# Altium project CANDAQ.PrjPCB
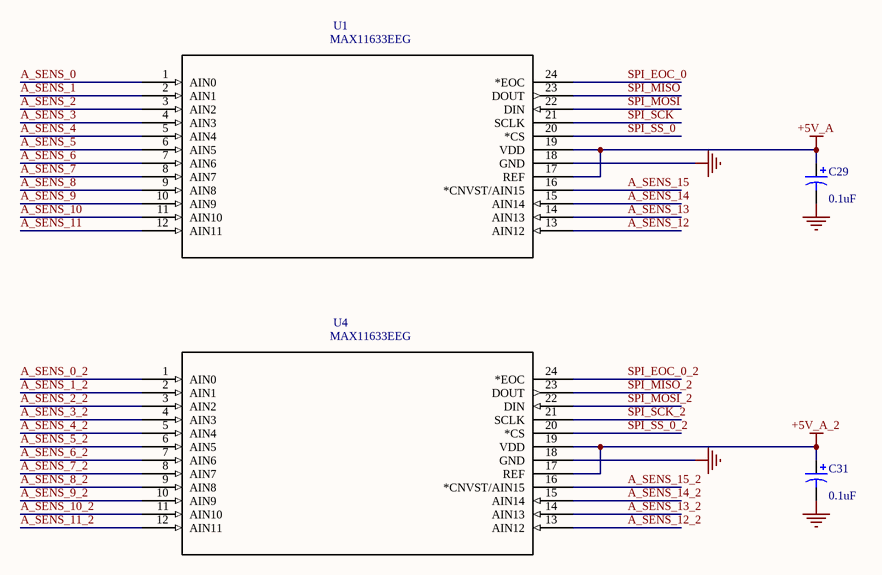
[diagram p0: ADC.SchDoc]
ProjectTitle: CANDAQ
9 sheets, 106 parts. Net scope: global (net labels, ports and power ports of the same name join across sheets).
Board file: CANDAQ.PcbDoc
Sheets:
  ADC.SchDoc
  Connectors.SchDoc
  Peripherials.SchDoc
  Microcontroller.SchDoc
  Strain Gauge Amplifiers.SchDoc
  Power.SchDoc
  Strain Gauge ADC.SchDoc
  bREAKOUT.SchDoc
  MicrocontrollerTwo.SchDoc

## Sheet ADC.SchDoc: 12 Bit ADC's
size Letter; Date: Jul 31/2018; Revision: 1; SheetNumber: 3; SheetTotal: 9

### Parts
(Parts that share a designator on the sheet are numbered #1, #2 ... from top to bottom, then left to right.)
C29#1  value 0.1uF  [1206-Polarized]  (hidden comment: Cap Pol3)
C31#1  value 0.1uF  [1206-Polarized]  (hidden comment: Cap Pol3)
U1  MAX11633EEG  [21-0055H_24]
U4#1  MAX11633EEG  [21-0055H_24]

### Nets
+5V_A: C29#1.1 U1.17(REF) U1.19(VDD)
+5V_A_2: C31#1.1 U4#1.17(REF) U4#1.19(VDD)
GND: C29#1.2 C31#1.2 U1.18(GND) U4#1.18(GND)
A_SENS_0: U1.1(AIN0)
A_SENS_0_2: U4#1.1(AIN0)
A_SENS_1: U1.2(AIN1)
A_SENS_1_2: U4#1.2(AIN1)
A_SENS_2: U1.3(AIN2)
A_SENS_2_2: U4#1.3(AIN2)
A_SENS_3: U1.4(AIN3)
A_SENS_3_2: U4#1.4(AIN3)
A_SENS_4: U1.5(AIN4)
A_SENS_4_2: U4#1.5(AIN4)
A_SENS_5: U1.6(AIN5)
A_SENS_5_2: U4#1.6(AIN5)
A_SENS_6: U1.7(AIN6)
A_SENS_6_2: U4#1.7(AIN6)
A_SENS_7: U1.8(AIN7)
A_SENS_7_2: U4#1.8(AIN7)
A_SENS_8: U1.9(AIN8)
A_SENS_8_2: U4#1.9(AIN8)
A_SENS_9: U1.10(AIN9)
A_SENS_9_2: U4#1.10(AIN9)
A_SENS_10: U1.11(AIN10)
A_SENS_10_2: U4#1.11(AIN10)
A_SENS_11: U1.12(AIN11)
A_SENS_11_2: U4#1.12(AIN11)
A_SENS_12: U1.13(AIN12)
A_SENS_12_2: U4#1.13(AIN12)
A_SENS_13: U1.14(AIN13)
A_SENS_13_2: U4#1.14(AIN13)
A_SENS_14: U1.15(AIN14)
A_SENS_14_2: U4#1.15(AIN14)
A_SENS_15: U1.16(*CNVST/AIN15)
A_SENS_15_2: U4#1.16(*CNVST/AIN15)
SPI_EOC_0: U1.24(*EOC)
SPI_EOC_0_2: U4#1.24(*EOC)
SPI_MISO: U1.23(DOUT)
SPI_MISO_2: U4#1.23(DOUT)
SPI_MOSI: U1.22(DIN)
SPI_MOSI_2: U4#1.22(DIN)
SPI_SCK: U1.21(SCLK)
SPI_SCK_2: U4#1.21(SCLK)
SPI_SS_0: U1.20(*CS)
SPI_SS_0_2: U4#1.20(*CS)

### Notes on the sheet
- Date:
- Revision:
- Sheet:
- /

### Library data of the parts
C29#1 C31#1 = Cap Pol3: Polarized Capacitor (Surface Mount); Published: 8-Jun-2000; LatestRevisionDate: 29-May-2009; LatestRevisionNote: IPC-7351 Footprint Added.; PackageReference: C0805; Publisher: Altium Limited; PackageDescription: Chip Capacitor
U1 U4#1 = MAX11633EEG: ADC Single SAR 300ksps 12-bit Serial 24-Pin QSOP; MP: MAX11633EEG+; MF: Maxim Integrated; SnapEDA_Link: https://www.snapeda.com/parts/MAX11633EEG%2B/Maxim%20Integrated/view-part/?ref=snap; Package: QSOP-24 Maxim Integrated; Digi-Key_Purchase_URL: https://www.digikey.ca/product-detail/en/maxim-integrated/MAX11633EEG-/MAX11633EEG--ND/2591497?utm_source=snapeda&utm_medium=aggregator&utm_campaign=symbol; Digi-Key_Part_Number: MAX11633EEG+-ND; Value: *

## Sheet Connectors.SchDoc: Connectors
size Letter; Date: Jul 31/2018; Revision: 1; SheetNumber: 4; SheetTotal: 9
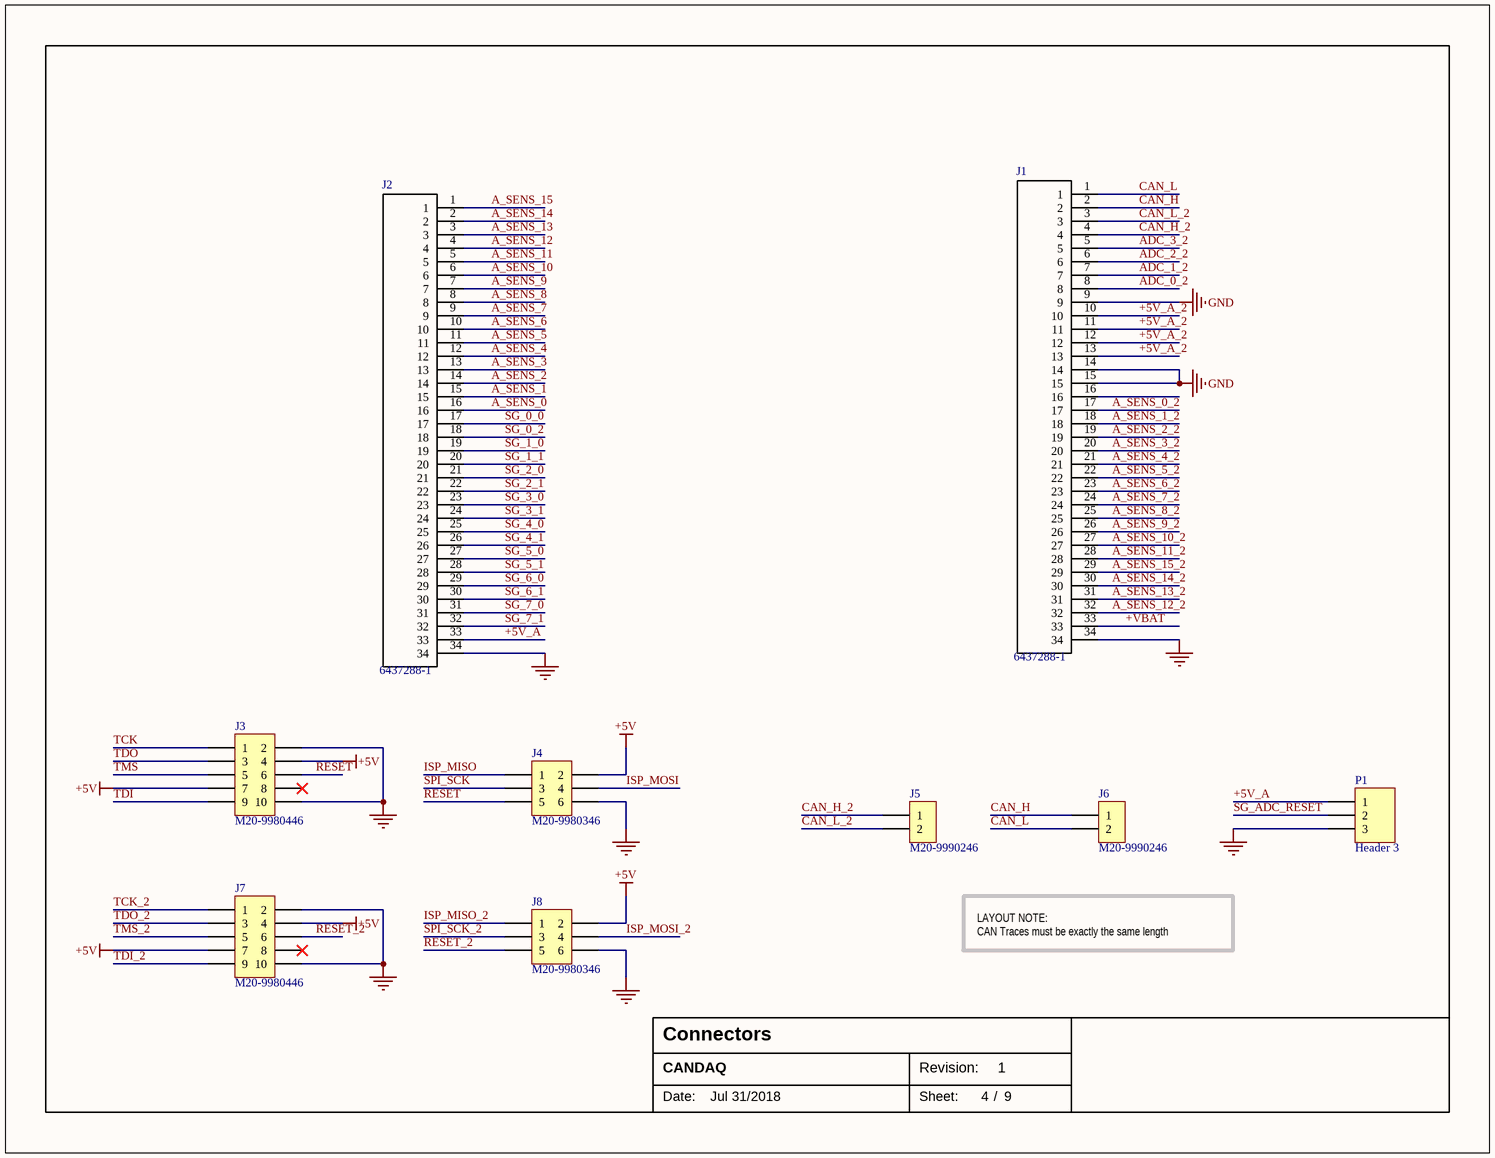
[diagram p1: Connectors.SchDoc]

### Parts
J1  6437288-1  [TE_6437288-1]
J2  6437288-1  [TE_6437288-1]
J3  M20-9980446  [M20-9980446]
J4  M20-9980346  [M20-9980346]
J5  M20-9990246  [M20-9990246]
J6  M20-9990246  [M20-9990246]
J7  M20-9980446  [M20-9980446]
J8  M20-9980346  [M20-9980346]
P1  Header 3  [HDR1X3]

### Nets
+5V: J3.4 J3.7 J4.2 J7.4 J7.7 J8.2
+5V_A: J2.33 P1.1
+5V_A_2: J1.10 J1.11 J1.12 J1.13
+VBAT: J1.33
GND: J1.9 J1.14 J1.15 J1.34 J2.34 J3.2 J3.10 J4.6 J7.2 J7.10 J8.6 P1.3
A_SENS_0: J2.16
A_SENS_0_2: J1.17
A_SENS_1: J2.15
A_SENS_1_2: J1.18
A_SENS_2: J2.14
A_SENS_2_2: J1.19
A_SENS_3: J2.13
A_SENS_3_2: J1.20
A_SENS_4: J2.12
A_SENS_4_2: J1.21
A_SENS_5: J2.11
A_SENS_5_2: J1.22
A_SENS_6: J2.10
A_SENS_6_2: J1.23
A_SENS_7: J2.9
A_SENS_7_2: J1.24
A_SENS_8: J2.8
A_SENS_8_2: J1.25
A_SENS_9: J2.7
A_SENS_9_2: J1.26
A_SENS_10: J2.6
A_SENS_10_2: J1.27
A_SENS_11: J2.5
A_SENS_11_2: J1.28
A_SENS_12: J2.4
A_SENS_12_2: J1.32
A_SENS_13: J2.3
A_SENS_13_2: J1.31
A_SENS_14: J2.2
A_SENS_14_2: J1.30
A_SENS_15: J2.1
A_SENS_15_2: J1.29
ADC_0_2: J1.8
ADC_1_2: J1.7
ADC_2_2: J1.6
ADC_3_2: J1.5
CAN_H: J1.2 J6.1
CAN_H_2: J1.4 J5.1
CAN_L: J1.1 J6.2
CAN_L_2: J1.3 J5.2
ISP_MISO: J4.1
ISP_MISO_2: J8.1
ISP_MOSI: J4.4
ISP_MOSI_2: J8.4
RESET: J3.6 J4.5
RESET_2: J7.6 J8.5
SG_0_0: J2.17
SG_0_2: J2.18
SG_1_0: J2.19
SG_1_1: J2.20
SG_2_0: J2.21
SG_2_1: J2.22
SG_3_0: J2.23
SG_3_1: J2.24
SG_4_0: J2.25
SG_4_1: J2.26
SG_5_0: J2.27
SG_5_1: J2.28
SG_6_0: J2.29
SG_6_1: J2.30
SG_7_0: J2.31
SG_7_1: J2.32
SG_ADC~{_RESET}: P1.2
SPI_SCK: J4.3
SPI_SCK_2: J8.3
TCK: J3.1
TCK_2: J7.1
TDI: J3.9
TDI_2: J7.9
TDO: J3.3
TDO_2: J7.3
TMS: J3.5
TMS_2: J7.5

Not connected (* = marked no-connect by the designer): J1 16; J3 8*; J7 8*

### Notes on the sheet
- LAYOUT NOTE:
  CAN Traces must be exactly the same length
- Date:
- Revision:
- Sheet:
- /

### Library data of the parts
J1 J2 = 6437288-1: 34 Position 4 Row Right Angle Receptacle Through Hole Super Seal Cap Assy; MF: TE Connectivity; SnapEDA_Link: https://www.snapeda.com/parts/6437288-1/TE%20Connectivity%20AMP%20Connectors/view-part/?ref=snap; Link: http://www.te.com/usa-en/product-6437288-1.html; Digi-Key_Part_Number: A124384-ND; EU_RoHS_Compliance: Compliant; Digi-Key_Purchase_URL: https://www.digikey.ca/product-detail/en/te-connectivity-amp-connectors/6437288-1/A124384-ND/5428601?utm_source=snapeda&utm_medium=aggregator&utm_campaign=symbol; MP: 6437288-1; Package: None; Value: *
J3 J7 = M20-9980446: 2.54mm Header 2x4-Pin
J4 J8 = M20-9980346: 2.54mm Header 2x3-Pin; Supplier 1: Digi-Key; Supplier Part Number 1: 952-2121-ND
J5 J6 = M20-9990246: 2.54mm Header 1x2-Pin; Supplier 1: Digi-Key; Supplier Part Number 1: 952-2262-ND
P1 = Header 3: Header, 3-Pin; LatestRevisionDate: 17-Jul-2002; LatestRevisionNote: Re-released for DXP Platform.; Publisher: Altium Limited

## Sheet Peripherials.SchDoc: Peripherials
size Letter; Date: Jul 31/2018; Revision: 1; SheetNumber: 8; SheetTotal: 9
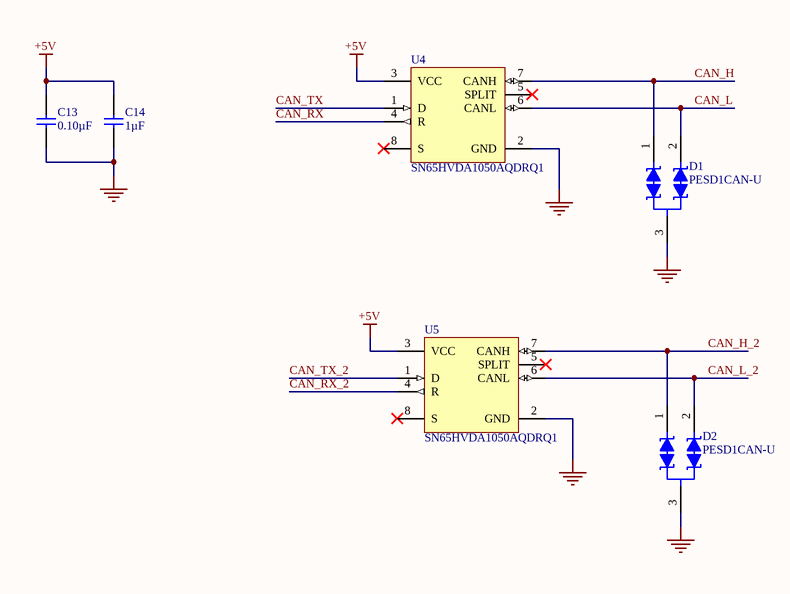
[diagram p2: Peripherials.SchDoc]

### Parts
(Parts that share a designator on the sheet are numbered #1, #2 ... from top to bottom, then left to right.)
C13  value 0.10µF  [1206]  (hidden comment: CAP 0.10µF ±10% 16V 0402 X7R)
C14  value 1µF  [1206]  (hidden comment: CAP 1µF ±10% 16V 0805 X7R)
D1  PESD1CAN-U  [SOT65P210X110-3N]
D2  PESD1CAN-U  [SOT65P210X110-3N]
U4#2  SN65HVDA1050AQDRQ1  [SOIC127P600X175-8M]
U5  SN65HVDA1050AQDRQ1  [SOIC127P600X175-8M]

### Nets
+5V: C13.2 C14.1 U4#2.3(VCC) U5.3(VCC)
GND: C13.1 C14.2 D1.3 D2.3 U4#2.2(GND) U5.2(GND)
CAN_H: D1.1 U4#2.7(CANH)
CAN_H_2: D2.1 U5.7(CANH)
CAN_L: D1.2 U4#2.6(CANL)
CAN_L_2: D2.2 U5.6(CANL)
CAN_RX: U4#2.4(R)
CAN_RX_2: U5.4(R)
CAN_TX: U4#2.1(D)
CAN_TX_2: U5.1(D)

Not connected (* = marked no-connect by the designer): U4#2 5(SPLIT)* 8(S)*; U5 5(SPLIT)* 8(S)*

### Notes on the sheet
- Date:
- Revision:
- Sheet:
- /

### Library data of the parts
C13 = CC0402KRX7R7BB104: Manufacturer: Yageo; Manufacturer Series: CC; Part Number: CC0402KRX7R7BB104; Component Type: Standard; Tolerance: ±10%; Voltage: 16V; Package: 0402; Temperature Coefficient: X7R; Temperature Range: -55°C ~ 125°C; Supplier 1: Digi-Key; Supplier Part Number 1: 311-1338-1-ND
C14 = CC0805KKX7R7BB105: Manufacturer: Yageo; Manufacturer Series: CC; Part Number: CC0805KKX7R7BB105; Component Type: Standard; Tolerance: ±10%; Voltage: 16V; Package: 0805; Temperature Coefficient: X7R; Temperature Range: -55°C ~ 125°C; Supplier 1: Digi-Key; Supplier Part Number 1: 311-1365-1-ND
U4#2 U5 = SN65HVDA1050AQDRQ1: CAN transceiver; Supplier 1: Digi-Key; Supplier Part Number 1: 296-25836-1-ND

## Sheet Microcontroller.SchDoc: Microcontroller
size Letter; Date: Jul 31/2018; Revision: 1; SheetNumber: 2; SheetTotal: 9
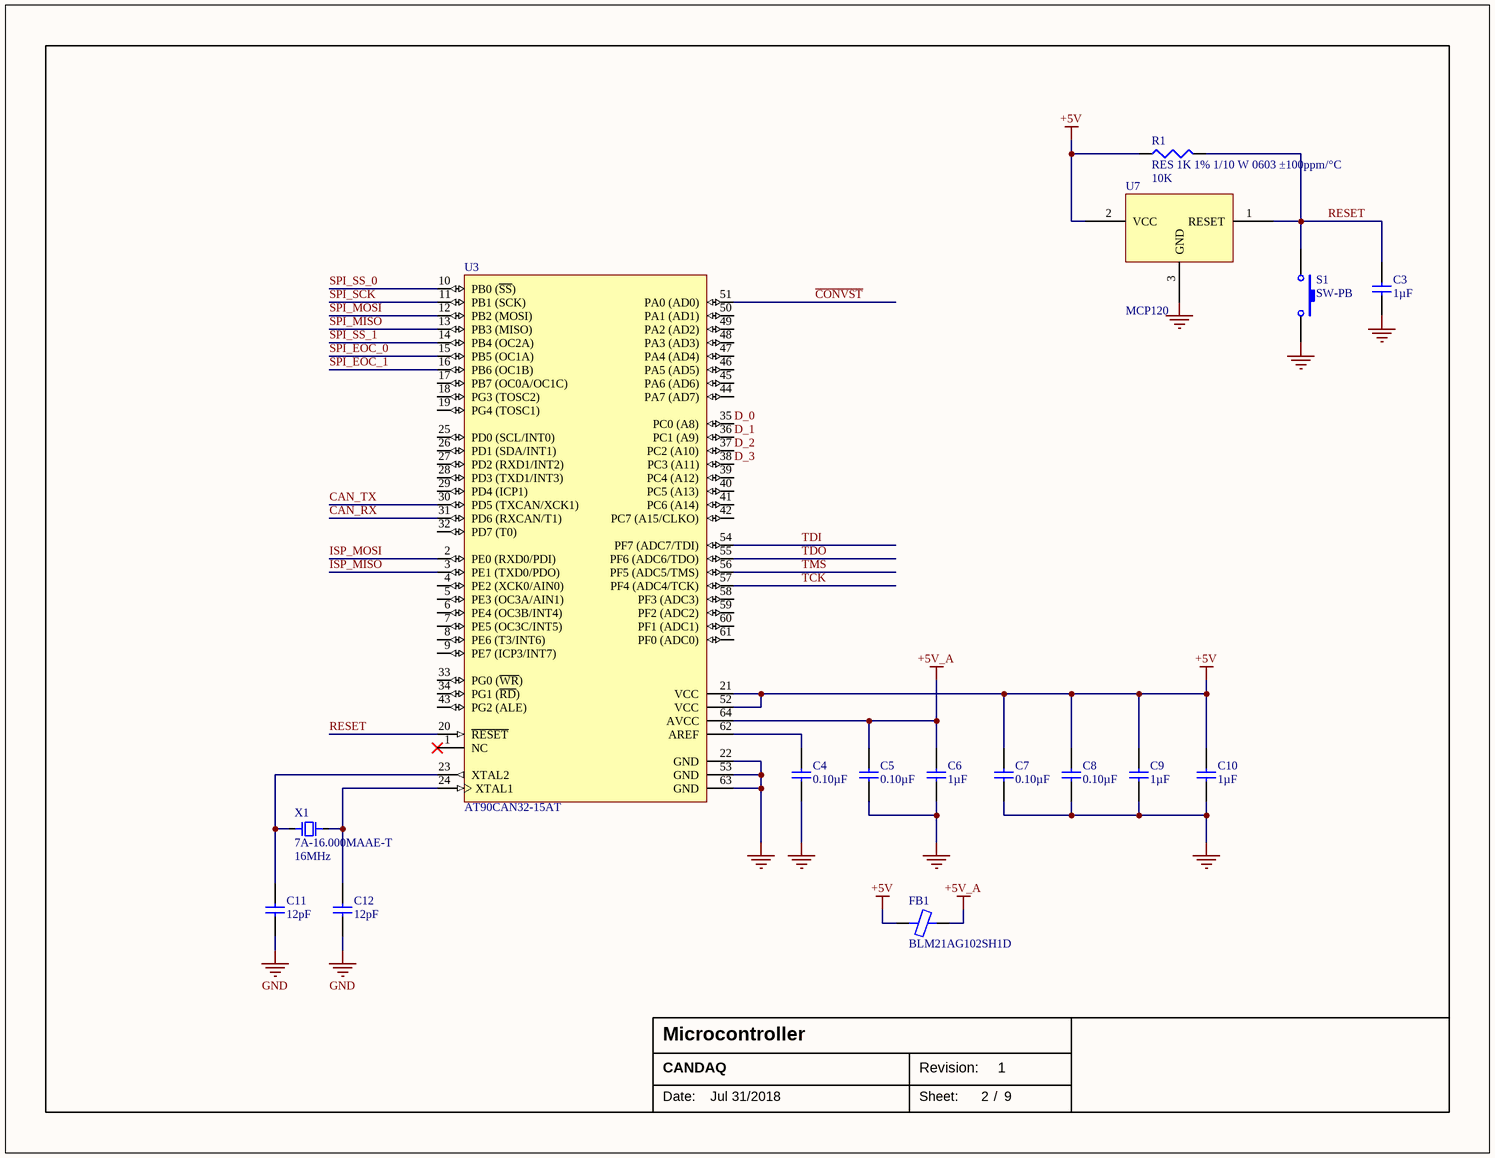
[diagram p3: Microcontroller.SchDoc]

### Parts
C3  value 1µF  [1206]  (hidden comment: CAP 1µF ±10% 16V 0805 X7R)
C4  value 0.10µF  [1206]  (hidden comment: CAP 0.10µF ±10% 16V 0402 X7R)
C5  value 0.10µF  [1206]  (hidden comment: CAP 0.10µF ±10% 16V 0402 X7R)
C6  value 1µF  [1206]  (hidden comment: CAP 1µF ±10% 16V 0805 X7R)
C7  value 0.10µF  [1206]  (hidden comment: CAP 0.10µF ±10% 16V 0402 X7R)
C8  value 0.10µF  [1206]  (hidden comment: CAP 0.10µF ±10% 16V 0402 X7R)
C9  value 1µF  [1206]  (hidden comment: CAP 1µF ±10% 16V 0805 X7R)
C10  value 1µF  [1206]  (hidden comment: CAP 1µF ±10% 16V 0805 X7R)
C11  value 12pF  [1206]  (hidden comment: CAP 12pF ±5% 50V 0402 C0G, NP0)
C12  value 12pF  [1206]  (hidden comment: CAP 12pF ±5% 50V 0402 C0G, NP0)
FB1  BLM21AG102SH1D  [INDC2012X11N]
R1  RES 1K 1% 1/10 W 0603 ±100ppm/°C  value 10K  [1206]
S1  SW-PB  [Switch]
U3  AT90CAN32-15AT  [TQFP80P1600X1600X120-64N]
U7  MCP120  [MCP120]
X1  7A-16.000MAAE-T  value 16MHz  [QFN200P500X320X135-2N]

### Nets
+5V: C7.2 C8.2 C9.1 C10.1 FB1.1 R1.1 U3.21(VCC) U3.52(VCC) U7.2(VCC)
+5V_A: C5.2 C6.1 FB1.2 U3.64(AVCC)
GND: C3.2 C4.1 C5.1 C6.2 C7.1 C8.1 C9.2 C10.2 C11.1 C12.1 S1.2 U3.22(GND) U3.53(GND) U3.63(GND) U7.3(GND)
~{CONVST}: U3.51(PA0_(AD0))
CAN_RX: U3.31(PD6_(RXCAN/T1))
CAN_TX: U3.30(PD5_(TXCAN/XCK1))
D_0: U3.35(PC0_(A8))
D_1: U3.36(PC1_(A9))
D_2: U3.37(PC2_(A10))
D_3: U3.38(PC3_(A11))
ISP_MISO: U3.3(PE1_(TXD0/PDO))
ISP_MOSI: U3.2(PE0_(RXD0/PDI))
RESET: C3.1 R1.2 S1.1 U3.20(~{RESET}) U7.1(RESET)
SPI_EOC_0: U3.15(PB5_(OC1A))
SPI_EOC_1: U3.16(PB6_(OC1B))
SPI_MISO: U3.13(PB3_(MISO))
SPI_MOSI: U3.12(PB2_(MOSI))
SPI_SCK: U3.11(PB1_(SCK))
SPI_SS_0: U3.10(PB0_(~{SS}))
SPI_SS_1: U3.14(PB4_(OC2A))
TCK: U3.57(PF4_(ADC4/TCK))
TDI: U3.54(PF7_(ADC7/TDI))
TDO: U3.55(PF6_(ADC6/TDO))
TMS: U3.56(PF5_(ADC5/TMS))
NetC4_2: C4.2 U3.62(AREF)
NetC11_2: C11.2 U3.23(XTAL2) X1.1
NetC12_2: C12.2 U3.24(XTAL1) X1.2

Not connected (* = marked no-connect by the designer): U3 1(NC)* 4(PE2_(XCK0/AIN0)) 5(PE3_(OC3A/AIN1)) 6(PE4_(OC3B/INT4)) 7(PE5_(OC3C/INT5)) 8(PE6_(T3/INT6)) 9(PE7_(ICP3/INT7)) 17(PB7_(OC0A/OC1C)) 18(PG3_(TOSC2)) 19(PG4_(TOSC1)) 25(PD0_(SCL/INT0)) 26(PD1_(SDA/INT1)) 27(PD2_(RXD1/INT2)) 28(PD3_(TXD1/INT3)) 29(PD4_(ICP1)) 32(PD7_(T0)) 33(PG0_(~{WR})) 34(PG1_(~{RD})) 39(PC4_(A12)) 40(PC5_(A13)) 41(PC6_(A14)) 42(PC7_(A15/CLKO)) 43(PG2_(ALE)) 44(PA7_(AD7)) 45(PA6_(AD6)) 46(PA5_(AD5)) 47(PA4_(AD4)) 48(PA3_(AD3)) 49(PA2_(AD2)) 50(PA1_(AD1)) 58(PF3_(ADC3)) 59(PF2_(ADC2)) 60(PF1_(ADC1)) 61(PF0_(ADC0))

### Notes on the sheet
- Date:
- Revision:
- Sheet:
- /

### Library data of the parts
C3 C6 C9 C10 = CC0805KKX7R7BB105: as C14 on sheet Peripherials; Part Number: CC0805KKX7R7BB105; Component Type: Standard; Tolerance: ±10%; Voltage: 16V; Package: 0805; Temperature Coefficient: X7R; Temperature Range: -55°C ~ 125°C; Supplier 1: Digi-Key; Supplier Part Number 1: 311-1365-1-ND
C4 C5 C7 C8 = CC0402KRX7R7BB104: as C13 on sheet Peripherials; Part Number: CC0402KRX7R7BB104; Component Type: Standard; Tolerance: ±10%; Voltage: 16V; Package: 0402; Temperature Coefficient: X7R; Temperature Range: -55°C ~ 125°C; Supplier 1: Digi-Key; Supplier Part Number 1: 311-1338-1-ND
C11 C12 = CC0402JRNPO9BN120: Manufacturer: Yageo; Manufacturer Series: CC; Part Number: CC0402JRNPO9BN120; Component Type: Standard; Tolerance: ±5%; Voltage: 50V; Package: 0402; Temperature Coefficient: C0G, NP0; Temperature Range: -55°C ~ 125°C; Supplier 1: Digi-Key; Supplier Part Number 1: 311-1016-1-ND
R1 = Res3: Resistor; Published: 8-Jun-2000; LatestRevisionDate: 29-May-2009; LatestRevisionNote: IPC-7351 Footprint Added.; PackageReference: J1-0603; Publisher: Altium Limited; PackageDescription: Chip Resistor
S1 = SW-PB: Switch; Published: 24-Mar-1999; LatestRevisionDate: 17-Jul-2002; LatestRevisionNote: Re-released for DXP Platform.; PackageReference: SPST-2; Publisher: Altium Limited; PackageDescription: Switch; 2 Leads
X1 = 7A-16.000MAAE-T: SMD Crystal Oscillator 12 pF; Load Capacitance: 12pF; Supplier 1: Digi-Key; Supplier Part Number 1: 887-1747-1-ND
FB1 = BLM21AG102SH1D: Supplier 1: Digi-Key; Supplier Part Number 1: 490-10664-1-ND
U3 = AT90CAN32-15AT: Supplier 1: Digi-Key; Supplier Part Number 1: AT90CAN32-15ATCT-ND

## Sheet Strain Gauge Amplifiers.SchDoc: SG Amplifiers
size Letter; Date: Jul 31/2018; Revision: 1; SheetNumber: 6; SheetTotal: 9
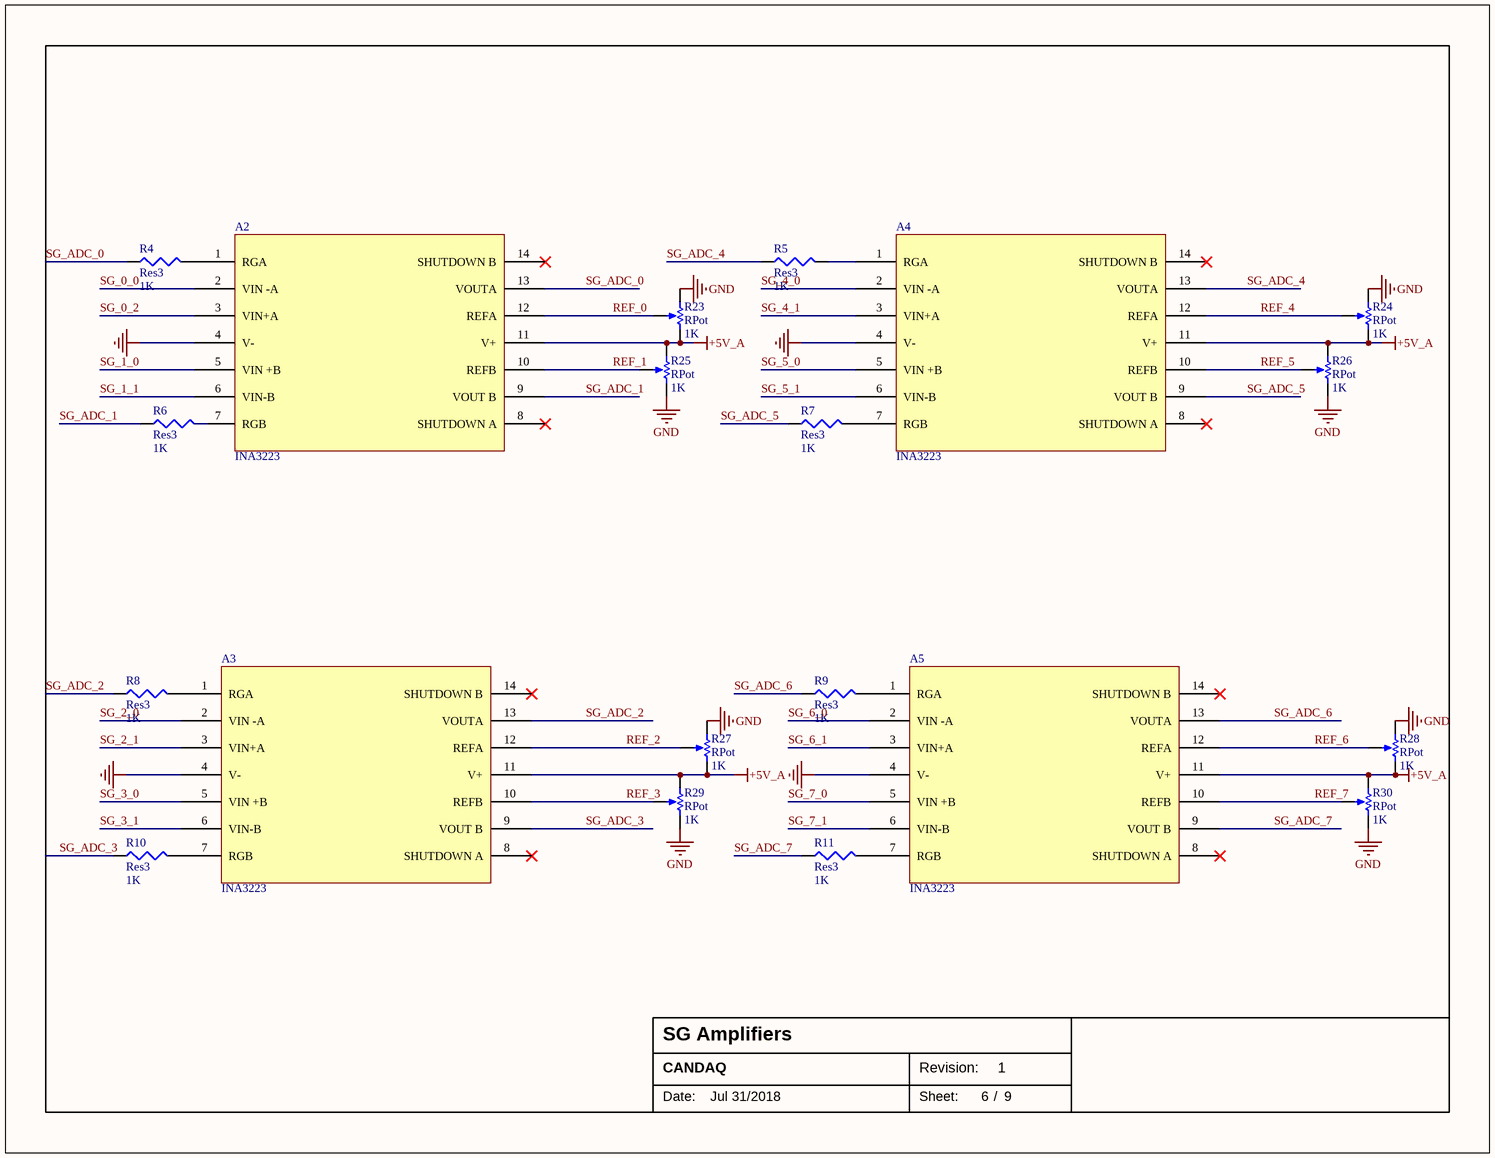
[diagram p4: Strain Gauge Amplifiers.SchDoc]

### Parts
A2  INA3223  [TSSOP-14]
A3  INA3223  [TSSOP-14]
A4  INA3223  [TSSOP-14]
A5  INA3223  [TSSOP-14]
R4  Res3  value 1K  [1206]
R5  Res3  value 1K  [1206]
R6  Res3  value 1K  [1206]
R7  Res3  value 1K  [1206]
R8  Res3  value 1K  [1206]
R9  Res3  value 1K  [1206]
R10  Res3  value 1K  [1206]
R11  Res3  value 1K  [1206]
R23  RPot  value 1K  [POT]
R24  RPot  value 1K  [POT]
R25  RPot  value 1K  [POT]
R26  RPot  value 1K  [POT]
R27  RPot  value 1K  [POT]
R28  RPot  value 1K  [POT]
R29  RPot  value 1K  [POT]
R30  RPot  value 1K  [POT]

### Nets
+5V_A: A2.11(V+) A3.11(V+) A4.11(V+) A5.11(V+) R23.2(BOT) R24.2(BOT) R25.1(TOP) R26.1(TOP) R27.2(BOT) R28.2(BOT) R29.1(TOP) R30.1(TOP)
GND: A2.4(V-) A3.4(V-) A4.4(V-) A5.4(V-) R23.1(TOP) R24.1(TOP) R25.2(BOT) R26.2(BOT) R27.1(TOP) R28.1(TOP) R29.2(BOT) R30.2(BOT)
REF_0: A2.12(REFA) R23.3(TAP)
REF_1: A2.10(REFB) R25.3(TAP)
REF_2: A3.12(REFA) R27.3(TAP)
REF_3: A3.10(REFB) R29.3(TAP)
REF_4: A4.12(REFA) R24.3(TAP)
REF_5: A4.10(REFB) R26.3(TAP)
REF_6: A5.12(REFA) R28.3(TAP)
REF_7: A5.10(REFB) R30.3(TAP)
SG_0_0: A2.2(VIN_-A)
SG_0_2: A2.3(VIN+A)
SG_1_0: A2.5(VIN_+B)
SG_1_1: A2.6(VIN-B)
SG_2_0: A3.2(VIN_-A)
SG_2_1: A3.3(VIN+A)
SG_3_0: A3.5(VIN_+B)
SG_3_1: A3.6(VIN-B)
SG_4_0: A4.2(VIN_-A)
SG_4_1: A4.3(VIN+A)
SG_5_0: A4.5(VIN_+B)
SG_5_1: A4.6(VIN-B)
SG_6_0: A5.2(VIN_-A)
SG_6_1: A5.3(VIN+A)
SG_7_0: A5.5(VIN_+B)
SG_7_1: A5.6(VIN-B)
SG_ADC_0: A2.13(VOUTA) R4.1
SG_ADC_1: A2.9(VOUT_B) R6.1
SG_ADC_2: A3.13(VOUTA) R8.1
SG_ADC_3: A3.9(VOUT_B) R10.1
SG_ADC_4: A4.13(VOUTA) R5.1
SG_ADC_5: A4.9(VOUT_B) R7.1
SG_ADC_6: A5.13(VOUTA) R9.1
SG_ADC_7: A5.9(VOUT_B) R11.1
NetA2_1: A2.1(RGA) R4.2
NetA2_7: A2.7(RGB) R6.2
NetA3_1: A3.1(RGA) R8.2
NetA3_7: A3.7(RGB) R10.2
NetA4_1: A4.1(RGA) R5.2
NetA4_7: A4.7(RGB) R7.2
NetA5_1: A5.1(RGA) R9.2
NetA5_7: A5.7(RGB) R11.2

Not connected (* = marked no-connect by the designer): A2 8(SHUTDOWN_A)* 14(SHUTDOWN_B)*; A3 8(SHUTDOWN_A)* 14(SHUTDOWN_B)*; A4 8(SHUTDOWN_A)* 14(SHUTDOWN_B)*; A5 8(SHUTDOWN_A)* 14(SHUTDOWN_B)*

### Notes on the sheet
- Date:
- Revision:
- Sheet:
- /

### Library data of the parts
R4-R11 = Res3: Resistor; Published: 8-Jun-2000; LatestRevisionDate: 29-May-2009; LatestRevisionNote: IPC-7351 Footprint Added.; PackageReference: J1-0603; Publisher: Altium Limited; PackageDescription: Chip Resistor
R23-R30 = RPot: Potentiometer; Sim Note: Enter the Resistance value and the set point into parameter fields.; Set Position: 0.5; Published: 8-Jun-2000; LatestRevisionDate: 17-Jul-2002; LatestRevisionNote: Re-released for DXP Platform.; PackageReference: VR5; Publisher: Altium Limited; PackageDescription: Variable Resistor, Thru-Hole; 3 Leads

## Sheet Power.SchDoc: Power and Circuit Prot
size Letter; Date: Jul 31/2018; Revision: 1; SheetNumber: 1; SheetTotal: 9
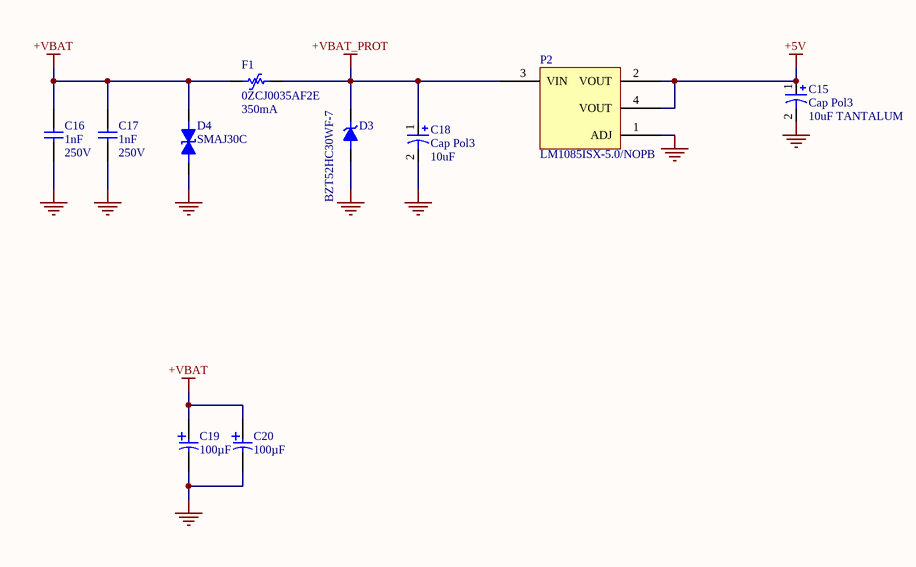
[diagram p5: Power.SchDoc]

### Parts
C15  Cap Pol3  value 10uF TANTALUM  [1206-Polarized]
C16  value 1nF  Voltage: 250V  [1206]  (hidden comment: CAP 1nF ±10% 250V 0805 X7R)
C17  value 1nF  Voltage: 250V  [1206]  (hidden comment: CAP 1nF ±10% 250V 0805 X7R)
C18  Cap Pol3  value 10uF  [1206-Polarized]
C19  value 100µF  [CAPAE7066X80M]  (hidden comment: EEE-FK1V101XP)
C20  value 100µF  [CAPAE7066X80M]  (hidden comment: EEE-FK1V101XP)
D3  BZT52HC30WF-7  [SODFL340X115-2N]
D4  SMAJ30C  [SON127P500X135-2N]
F1  0ZCJ0035AF2E  value 350mA  [0ZCJ-1206-0.9]
P2  LM1085ISX-5.0/NOPB  [TO-263]

### Nets
+5V: C15.1 P2.2(VOUT) P2.4(VOUT)
+VBAT: C16.1 C17.1 C19.2 C20.2 D4.1 F1.1
+VBAT_PROT: C18.1 D3.1(K) F1.2 P2.3(VIN)
GND: C15.2 C16.2 C17.2 C18.2 C19.1 C20.1 D3.2(A) D4.2 P2.1(ADJ)

### Notes on the sheet
- Date:
- Revision:
- Sheet:
- /

### Library data of the parts
C15 C18 = Cap Pol3: Polarized Capacitor (Surface Mount); Published: 8-Jun-2000; LatestRevisionDate: 29-May-2009; LatestRevisionNote: IPC-7351 Footprint Added.; PackageReference: C0805; Publisher: Altium Limited; PackageDescription: Chip Capacitor
C16 C17 = CC0805KRX7RYBB102: Manufacturer: Yageo; Manufacturer Series: CC; Part Number: CC0805KRX7RYBB102; Component Type: Standard; Tolerance: ±10%; Package: 0805; Temperature Coefficient: X7R; Temperature Range: -55°C ~ 125°C; Supplier 1: Digi-Key; Supplier Part Number 1: 311-1470-1-ND
C19 C20 = EEE-FK1V101XP: Supplier 1: Digi-Key; Supplier Part Number 1: PCE3836CT-ND
D3 = BZT52HC30WF-7: Supplier 1: Digi-Key; Supplier Part Number 1: BZT52HC30WF-7DICT-ND

## Sheet Strain Gauge ADC.SchDoc: SG ADC
size Letter; Date: Jul 31/2018; Revision: 1; SheetNumber: 5; SheetTotal: 9
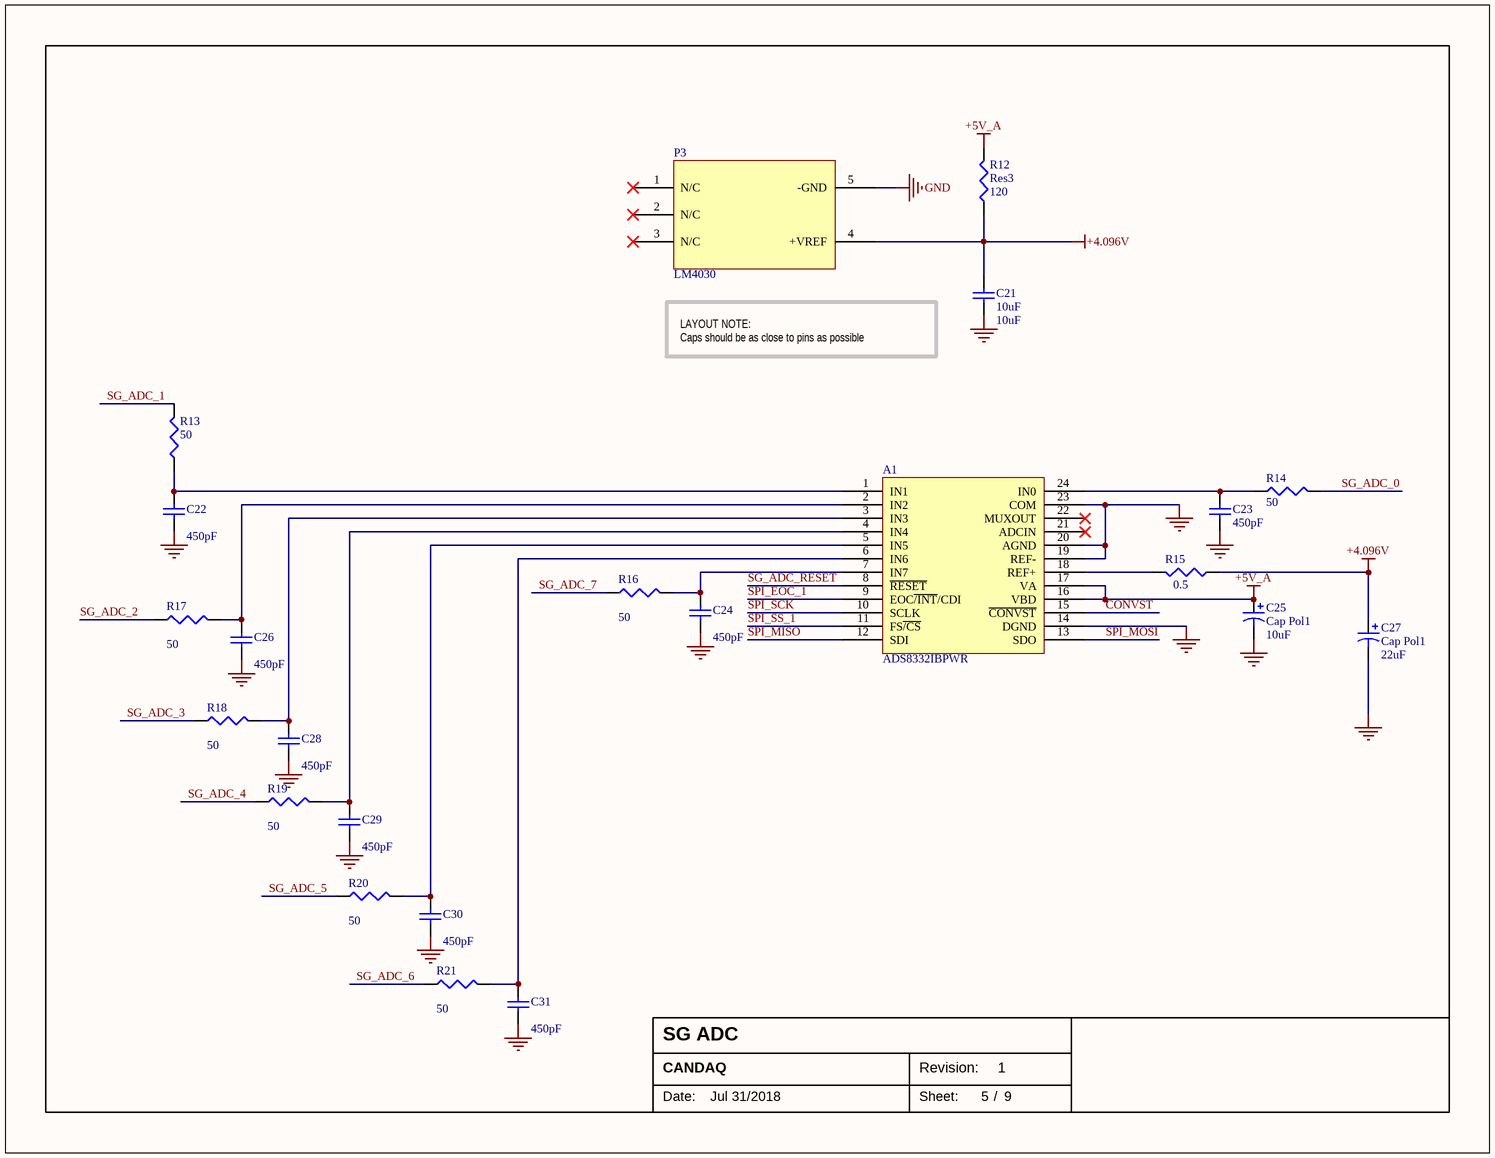
[diagram p6: Strain Gauge ADC.SchDoc]

### Parts
(Parts that share a designator on the sheet are numbered #1, #2 ... from top to bottom, then left to right.)
A1  ADS8332IBPWR  [TSSOP-24]
C21  10uF  [1206]
C22  value 450pF  [1206]  (hidden comment: Cap Semi)
C23  value 450pF  [1206]  (hidden comment: Cap Semi)
C24  value 450pF  [1206]  (hidden comment: Cap Semi)
C25  Cap Pol1  value 10uF  [1206-Polarized]
C26  value 450pF  [1206]  (hidden comment: Cap Semi)
C27  Cap Pol1  value 22uF  [1206-Polarized]
C28  value 450pF  [1206]  (hidden comment: Cap Semi)
C29#2  value 450pF  [1206]  (hidden comment: Cap Semi)
C30  value 450pF  [1206]  (hidden comment: Cap Semi)
C31#2  value 450pF  [1206]  (hidden comment: Cap Semi)
P3  LM4030  [so-23]
R12  Res3  value 120  [1206]
R13  value 50  [1206]  (hidden comment: Res3)
R14  value 50  [1206]  (hidden comment: Res3)
R15  value 0.5  [1206]  (hidden comment: Res3)
R16  value 50  [1206]  (hidden comment: Res3)
R17  value 50  [1206]  (hidden comment: Res3)
R18  value 50  [1206]  (hidden comment: Res3)
R19  value 50  [1206]  (hidden comment: Res3)
R20  value 50  [1206]  (hidden comment: Res3)
R21  value 50  [1206]  (hidden comment: Res3)

### Nets
+4.096V: C21.2 C27.1 P3.4(+VREF) R12.1 R15.1
+5V_A: A1.16(VBD) A1.17(VA) C25.1 R12.2
GND: A1.14(DGND) A1.19(REF-) A1.20(AGND) A1.23(COM) C21.1 C22.1 C23.1 C24.1 C25.2 C26.1 C27.2 C28.1 C29#2.1 C30.1 C31#2.1 P3.5(-GND)
~{CONVST}: A1.15(~{CONVST})
SG_ADC_0: R14.2
SG_ADC_1: R13.2
SG_ADC_2: R17.1
SG_ADC_3: R18.1
SG_ADC_4: R19.1
SG_ADC_5: R20.1
SG_ADC_6: R21.1
SG_ADC_7: R16.1
SG_ADC~{_RESET}: A1.8(~{RESET})
SPI_EOC_1: A1.9(EOC~{/INT}/CDI)
SPI_MISO: A1.12(SDI)
SPI_MOSI: A1.13(SDO)
SPI_SCK: A1.10(SCLK)
SPI_SS_1: A1.11(FS~{/CS})
NetA1_1: A1.1(IN1) C22.2 R13.1
NetA1_2: A1.2(IN2) C26.2 R17.2
NetA1_3: A1.3(IN3) C28.2 R18.2
NetA1_4: A1.4(IN4) C29#2.2 R19.2
NetA1_5: A1.5(IN5) C30.2 R20.2
NetA1_6: A1.6(IN6) C31#2.2 R21.2
NetA1_7: A1.7(IN7) C24.2 R16.2
NetA1_18: A1.18(REF+) R15.2
NetA1_24: A1.24(IN0) C23.2 R14.1

Not connected (* = marked no-connect by the designer): A1 21(ADCIN)* 22(MUXOUT)*; P3 1(N/C)* 2(N/C)* 3(N/C)*

### Notes on the sheet
- LAYOUT NOTE:
  Caps should be as close to pins as possible
- Date:
- Revision:
- Sheet:
- /

### Library data of the parts
C21-C24 C26 C28 C29#2 C30 C31#2 = Cap Semi: Capacitor (Semiconductor SIM Model); Published: 8-Jun-2000; LatestRevisionDate: 29-May-2009; LatestRevisionNote: IPC-7351 Footprint Added.; PackageReference: C1206; Publisher: Altium Limited; PackageDescription: Chip Capacitor
  C21: Value: 10uF
C25 C27 = Cap Pol1: Polarized Capacitor (Radial); Published: 8-Jun-2000; LatestRevisionDate: 17-Jul-2002; LatestRevisionNote: Re-released for DXP Platform.; PackageReference: RB7.6-15; Publisher: Altium Limited; PackageDescription: Polarized Capacitor (Radial); 2 Leads
R12-R21 = Res3: Resistor; Published: 8-Jun-2000; LatestRevisionDate: 29-May-2009; LatestRevisionNote: IPC-7351 Footprint Added.; PackageReference: J1-0603; Publisher: Altium Limited; PackageDescription: Chip Resistor

## Sheet bREAKOUT.SchDoc: Breakout Points
size Letter; Date: Jul 31/2018; Revision: 1; SheetNumber: 9; SheetTotal: 9
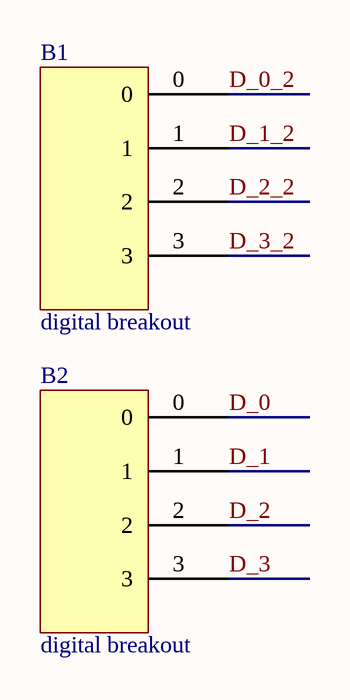
[diagram p7: bREAKOUT.SchDoc]

### Parts
B1  digital breakout  [Digital_I/O]
B2  digital breakout  [Digital_I/O]

### Nets
D_0: B2.0
D_0_2: B1.0
D_1: B2.1
D_1_2: B1.1
D_2: B2.2
D_2_2: B1.2
D_3: B2.3
D_3_2: B1.3

### Notes on the sheet
- Date:
- Revision:
- Sheet:
- /

### Library data of the parts
B1 B2 = Digital_I/O

## Sheet MicrocontrollerTwo.SchDoc: Microcontroller 2
size Letter; Date: Jul 31/2018; Revision: 1; SheetNumber: 7; SheetTotal: 9
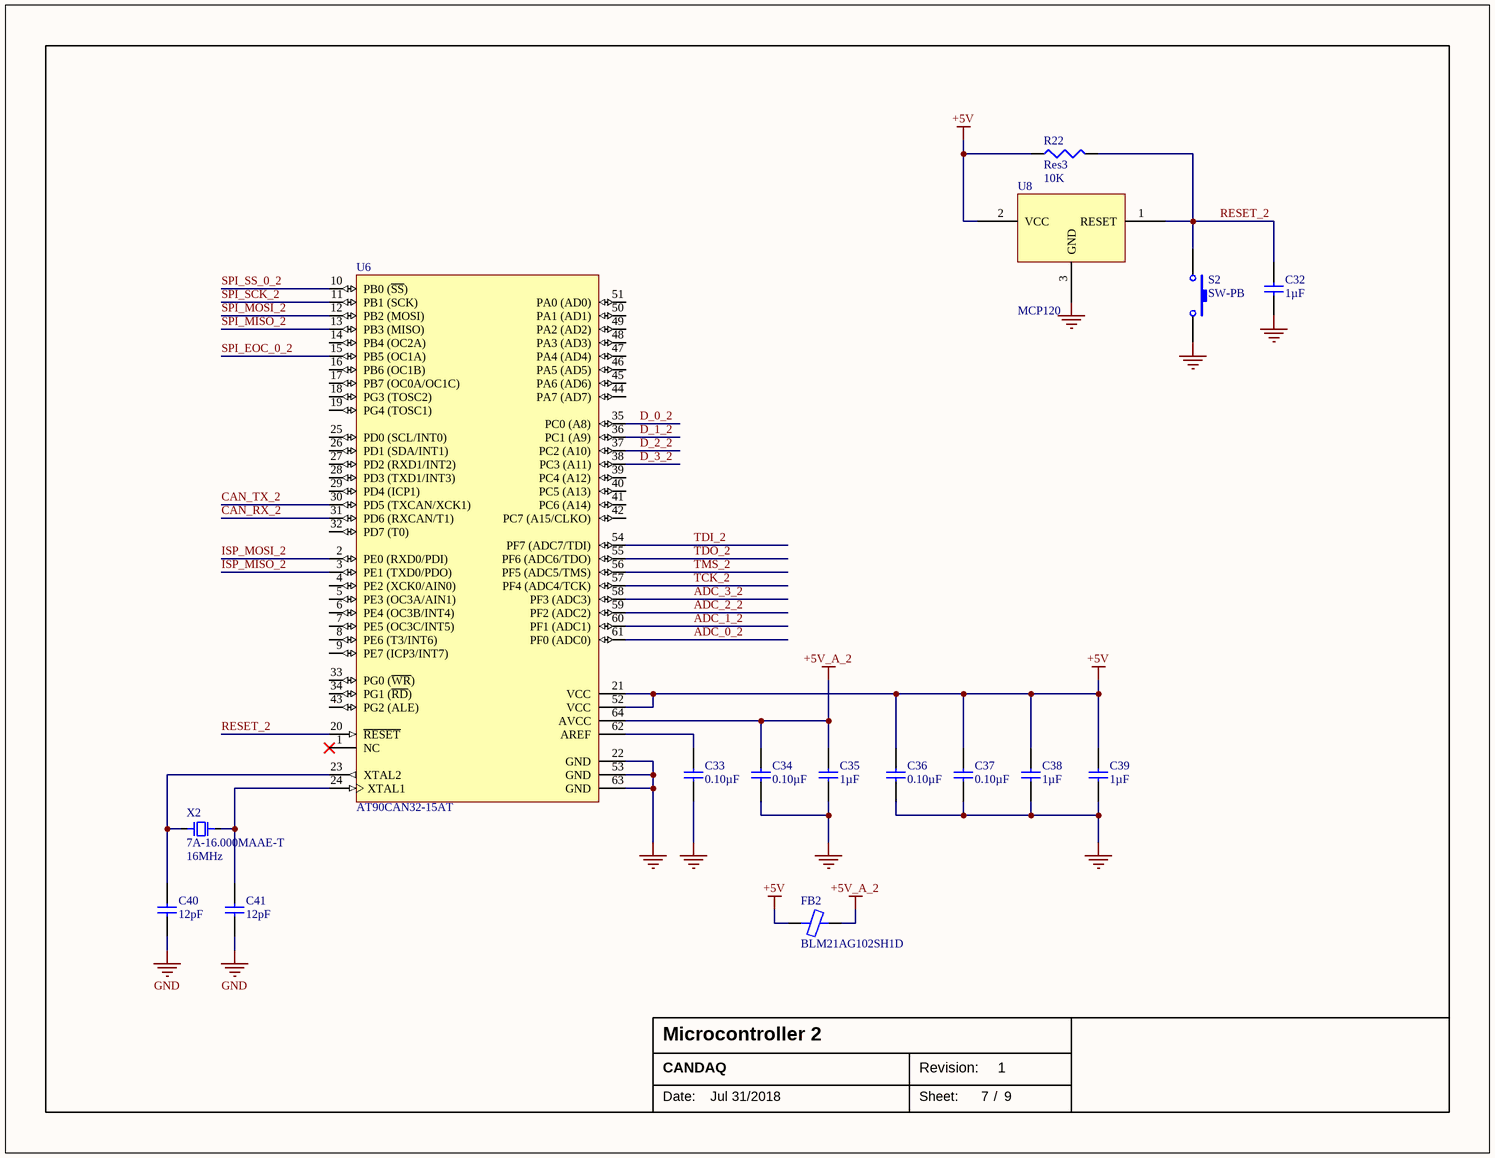
[diagram p8: MicrocontrollerTwo.SchDoc]

### Parts
C32  value 1µF  [1206]  (hidden comment: CAP 1µF ±10% 16V 0805 X7R)
C33  value 0.10µF  [1206]  (hidden comment: CAP 0.10µF ±10% 16V 0402 X7R)
C34  value 0.10µF  [1206]  (hidden comment: CAP 0.10µF ±10% 16V 0402 X7R)
C35  value 1µF  [1206]  (hidden comment: CAP 1µF ±10% 16V 0805 X7R)
C36  value 0.10µF  [1206]  (hidden comment: CAP 0.10µF ±10% 16V 0402 X7R)
C37  value 0.10µF  [1206]  (hidden comment: CAP 0.10µF ±10% 16V 0402 X7R)
C38  value 1µF  [1206]  (hidden comment: CAP 1µF ±10% 16V 0805 X7R)
C39  value 1µF  [1206]  (hidden comment: CAP 1µF ±10% 16V 0805 X7R)
C40  value 12pF  [1206]  (hidden comment: CAP 12pF ±5% 50V 0402 C0G, NP0)
C41  value 12pF  [1206]  (hidden comment: CAP 12pF ±5% 50V 0402 C0G, NP0)
FB2  BLM21AG102SH1D  [INDC2012X11N]
R22  Res3  value 10K  [1206]
S2  SW-PB  [Switch]
U6  AT90CAN32-15AT  [TQFP80P1600X1600X120-64N]
U8  MCP120  [MCP120]
X2  7A-16.000MAAE-T  value 16MHz  [QFN200P500X320X135-2N]

### Nets
+5V: C36.2 C37.2 C38.1 C39.1 FB2.1 R22.1 U6.21(VCC) U6.52(VCC) U8.2(VCC)
+5V_A_2: C34.2 C35.1 FB2.2 U6.64(AVCC)
GND: C32.2 C33.1 C34.1 C35.2 C36.1 C37.1 C38.2 C39.2 C40.1 C41.1 S2.2 U6.22(GND) U6.53(GND) U6.63(GND) U8.3(GND)
ADC_0_2: U6.61(PF0_(ADC0))
ADC_1_2: U6.60(PF1_(ADC1))
ADC_2_2: U6.59(PF2_(ADC2))
ADC_3_2: U6.58(PF3_(ADC3))
CAN_RX_2: U6.31(PD6_(RXCAN/T1))
CAN_TX_2: U6.30(PD5_(TXCAN/XCK1))
D_0_2: U6.35(PC0_(A8))
D_1_2: U6.36(PC1_(A9))
D_2_2: U6.37(PC2_(A10))
D_3_2: U6.38(PC3_(A11))
ISP_MISO_2: U6.3(PE1_(TXD0/PDO))
ISP_MOSI_2: U6.2(PE0_(RXD0/PDI))
RESET_2: C32.1 R22.2 S2.1 U6.20(~{RESET}) U8.1(RESET)
SPI_EOC_0_2: U6.15(PB5_(OC1A))
SPI_MISO_2: U6.13(PB3_(MISO))
SPI_MOSI_2: U6.12(PB2_(MOSI))
SPI_SCK_2: U6.11(PB1_(SCK))
SPI_SS_0_2: U6.10(PB0_(~{SS}))
TCK_2: U6.57(PF4_(ADC4/TCK))
TDI_2: U6.54(PF7_(ADC7/TDI))
TDO_2: U6.55(PF6_(ADC6/TDO))
TMS_2: U6.56(PF5_(ADC5/TMS))
NetC33_2: C33.2 U6.62(AREF)
NetC40_2: C40.2 U6.23(XTAL2) X2.1
NetC41_2: C41.2 U6.24(XTAL1) X2.2

Not connected (* = marked no-connect by the designer): U6 1(NC)* 4(PE2_(XCK0/AIN0)) 5(PE3_(OC3A/AIN1)) 6(PE4_(OC3B/INT4)) 7(PE5_(OC3C/INT5)) 8(PE6_(T3/INT6)) 9(PE7_(ICP3/INT7)) 14(PB4_(OC2A)) 16(PB6_(OC1B)) 17(PB7_(OC0A/OC1C)) 18(PG3_(TOSC2)) 19(PG4_(TOSC1)) 25(PD0_(SCL/INT0)) 26(PD1_(SDA/INT1)) 27(PD2_(RXD1/INT2)) 28(PD3_(TXD1/INT3)) 29(PD4_(ICP1)) 32(PD7_(T0)) 33(PG0_(~{WR})) 34(PG1_(~{RD})) 39(PC4_(A12)) 40(PC5_(A13)) 41(PC6_(A14)) 42(PC7_(A15/CLKO)) 43(PG2_(ALE)) 44(PA7_(AD7)) 45(PA6_(AD6)) 46(PA5_(AD5)) 47(PA4_(AD4)) 48(PA3_(AD3)) 49(PA2_(AD2)) 50(PA1_(AD1)) 51(PA0_(AD0))

### Notes on the sheet
- Date:
- Revision:
- Sheet:
- /

### Library data of the parts
C32 C35 C38 C39 = CC0805KKX7R7BB105: as C14 on sheet Peripherials; Part Number: CC0805KKX7R7BB105; Component Type: Standard; Tolerance: ±10%; Voltage: 16V; Package: 0805; Temperature Coefficient: X7R; Temperature Range: -55°C ~ 125°C; Supplier 1: Digi-Key; Supplier Part Number 1: 311-1365-1-ND
C33 C34 C36 C37 = CC0402KRX7R7BB104: as C13 on sheet Peripherials; Part Number: CC0402KRX7R7BB104; Component Type: Standard; Tolerance: ±10%; Voltage: 16V; Package: 0402; Temperature Coefficient: X7R; Temperature Range: -55°C ~ 125°C; Supplier 1: Digi-Key; Supplier Part Number 1: 311-1338-1-ND
C40 C41 = CC0402JRNPO9BN120: as C11 on sheet Microcontroller; Part Number: CC0402JRNPO9BN120; Component Type: Standard; Tolerance: ±5%; Voltage: 50V; Package: 0402; Temperature Coefficient: C0G, NP0; Temperature Range: -55°C ~ 125°C; Supplier 1: Digi-Key; Supplier Part Number 1: 311-1016-1-ND
R22 = Res3: Resistor; Published: 8-Jun-2000; LatestRevisionDate: 29-May-2009; LatestRevisionNote: IPC-7351 Footprint Added.; PackageReference: J1-0603; Publisher: Altium Limited; PackageDescription: Chip Resistor
S2 = SW-PB: Switch; Published: 24-Mar-1999; LatestRevisionDate: 17-Jul-2002; LatestRevisionNote: Re-released for DXP Platform.; PackageReference: SPST-2; Publisher: Altium Limited; PackageDescription: Switch; 2 Leads
X2 = 7A-16.000MAAE-T: as X1 on sheet Microcontroller; Supplier 1: Digi-Key; Supplier Part Number 1: 887-1747-1-ND
FB2 = BLM21AG102SH1D: Supplier 1: Digi-Key; Supplier Part Number 1: 490-10664-1-ND
U6 = AT90CAN32-15AT: Supplier 1: Digi-Key; Supplier Part Number 1: AT90CAN32-15ATCT-ND

## Nets that join several sheets
+5V: Connectors (6 pins), Peripherials (C13.2 C14.1 U4#2.3 U5.3), Microcontroller (9 pins), Power (C15.1 P2.2 P2.4), MicrocontrollerTwo (9 pins)
+5V_A: ADC (C29#1.1 U1.17 U1.19), Connectors (J2.33 P1.1), Microcontroller (C5.2 C6.1 FB1.2 U3.64), Strain Gauge Amplifiers (12 pins), Strain Gauge ADC (A1.16 A1.17 C25.1 R12.2)
+5V_A_2: ADC (C31#1.1 U4#1.17 U4#1.19), Connectors (J1.10 J1.11 J1.12 J1.13), MicrocontrollerTwo (C34.2 C35.1 FB2.2 U6.64)
+VBAT: Connectors (J1.33), Power (6 pins)
GND: ADC (C29#1.2 C31#1.2 U1.18 U4#1.18), Connectors (12 pins), Peripherials (6 pins), Microcontroller (15 pins), Strain Gauge Amplifiers (12 pins), Power (9 pins), Strain Gauge ADC (16 pins), MicrocontrollerTwo (15 pins)
~{CONVST}: Microcontroller (U3.51), Strain Gauge ADC (A1.15)
A_SENS_0: ADC (U1.1), Connectors (J2.16)
A_SENS_0_2: ADC (U4#1.1), Connectors (J1.17)
A_SENS_1: ADC (U1.2), Connectors (J2.15)
A_SENS_1_2: ADC (U4#1.2), Connectors (J1.18)
A_SENS_2: ADC (U1.3), Connectors (J2.14)
A_SENS_2_2: ADC (U4#1.3), Connectors (J1.19)
A_SENS_3: ADC (U1.4), Connectors (J2.13)
A_SENS_3_2: ADC (U4#1.4), Connectors (J1.20)
A_SENS_4: ADC (U1.5), Connectors (J2.12)
A_SENS_4_2: ADC (U4#1.5), Connectors (J1.21)
A_SENS_5: ADC (U1.6), Connectors (J2.11)
A_SENS_5_2: ADC (U4#1.6), Connectors (J1.22)
A_SENS_6: ADC (U1.7), Connectors (J2.10)
A_SENS_6_2: ADC (U4#1.7), Connectors (J1.23)
A_SENS_7: ADC (U1.8), Connectors (J2.9)
A_SENS_7_2: ADC (U4#1.8), Connectors (J1.24)
A_SENS_8: ADC (U1.9), Connectors (J2.8)
A_SENS_8_2: ADC (U4#1.9), Connectors (J1.25)
A_SENS_9: ADC (U1.10), Connectors (J2.7)
A_SENS_9_2: ADC (U4#1.10), Connectors (J1.26)
A_SENS_10: ADC (U1.11), Connectors (J2.6)
A_SENS_10_2: ADC (U4#1.11), Connectors (J1.27)
A_SENS_11: ADC (U1.12), Connectors (J2.5)
A_SENS_11_2: ADC (U4#1.12), Connectors (J1.28)
A_SENS_12: ADC (U1.13), Connectors (J2.4)
A_SENS_12_2: ADC (U4#1.13), Connectors (J1.32)
A_SENS_13: ADC (U1.14), Connectors (J2.3)
A_SENS_13_2: ADC (U4#1.14), Connectors (J1.31)
A_SENS_14: ADC (U1.15), Connectors (J2.2)
A_SENS_14_2: ADC (U4#1.15), Connectors (J1.30)
A_SENS_15: ADC (U1.16), Connectors (J2.1)
A_SENS_15_2: ADC (U4#1.16), Connectors (J1.29)
ADC_0_2: Connectors (J1.8), MicrocontrollerTwo (U6.61)
ADC_1_2: Connectors (J1.7), MicrocontrollerTwo (U6.60)
ADC_2_2: Connectors (J1.6), MicrocontrollerTwo (U6.59)
ADC_3_2: Connectors (J1.5), MicrocontrollerTwo (U6.58)
CAN_H: Connectors (J1.2 J6.1), Peripherials (D1.1 U4#2.7)
CAN_H_2: Connectors (J1.4 J5.1), Peripherials (D2.1 U5.7)
CAN_L: Connectors (J1.1 J6.2), Peripherials (D1.2 U4#2.6)
CAN_L_2: Connectors (J1.3 J5.2), Peripherials (D2.2 U5.6)
CAN_RX: Peripherials (U4#2.4), Microcontroller (U3.31)
CAN_RX_2: Peripherials (U5.4), MicrocontrollerTwo (U6.31)
CAN_TX: Peripherials (U4#2.1), Microcontroller (U3.30)
CAN_TX_2: Peripherials (U5.1), MicrocontrollerTwo (U6.30)
D_0: Microcontroller (U3.35), bREAKOUT (B2.0)
D_0_2: bREAKOUT (B1.0), MicrocontrollerTwo (U6.35)
D_1: Microcontroller (U3.36), bREAKOUT (B2.1)
D_1_2: bREAKOUT (B1.1), MicrocontrollerTwo (U6.36)
D_2: Microcontroller (U3.37), bREAKOUT (B2.2)
D_2_2: bREAKOUT (B1.2), MicrocontrollerTwo (U6.37)
D_3: Microcontroller (U3.38), bREAKOUT (B2.3)
D_3_2: bREAKOUT (B1.3), MicrocontrollerTwo (U6.38)
ISP_MISO: Connectors (J4.1), Microcontroller (U3.3)
ISP_MISO_2: Connectors (J8.1), MicrocontrollerTwo (U6.3)
ISP_MOSI: Connectors (J4.4), Microcontroller (U3.2)
ISP_MOSI_2: Connectors (J8.4), MicrocontrollerTwo (U6.2)
RESET: Connectors (J3.6 J4.5), Microcontroller (5 pins)
RESET_2: Connectors (J7.6 J8.5), MicrocontrollerTwo (5 pins)
SG_0_0: Connectors (J2.17), Strain Gauge Amplifiers (A2.2)
SG_0_2: Connectors (J2.18), Strain Gauge Amplifiers (A2.3)
SG_1_0: Connectors (J2.19), Strain Gauge Amplifiers (A2.5)
SG_1_1: Connectors (J2.20), Strain Gauge Amplifiers (A2.6)
SG_2_0: Connectors (J2.21), Strain Gauge Amplifiers (A3.2)
SG_2_1: Connectors (J2.22), Strain Gauge Amplifiers (A3.3)
SG_3_0: Connectors (J2.23), Strain Gauge Amplifiers (A3.5)
SG_3_1: Connectors (J2.24), Strain Gauge Amplifiers (A3.6)
SG_4_0: Connectors (J2.25), Strain Gauge Amplifiers (A4.2)
SG_4_1: Connectors (J2.26), Strain Gauge Amplifiers (A4.3)
SG_5_0: Connectors (J2.27), Strain Gauge Amplifiers (A4.5)
SG_5_1: Connectors (J2.28), Strain Gauge Amplifiers (A4.6)
SG_6_0: Connectors (J2.29), Strain Gauge Amplifiers (A5.2)
SG_6_1: Connectors (J2.30), Strain Gauge Amplifiers (A5.3)
SG_7_0: Connectors (J2.31), Strain Gauge Amplifiers (A5.5)
SG_7_1: Connectors (J2.32), Strain Gauge Amplifiers (A5.6)
SG_ADC_0: Strain Gauge Amplifiers (A2.13 R4.1), Strain Gauge ADC (R14.2)
SG_ADC_1: Strain Gauge Amplifiers (A2.9 R6.1), Strain Gauge ADC (R13.2)
SG_ADC_2: Strain Gauge Amplifiers (A3.13 R8.1), Strain Gauge ADC (R17.1)
SG_ADC_3: Strain Gauge Amplifiers (A3.9 R10.1), Strain Gauge ADC (R18.1)
SG_ADC_4: Strain Gauge Amplifiers (A4.13 R5.1), Strain Gauge ADC (R19.1)
SG_ADC_5: Strain Gauge Amplifiers (A4.9 R7.1), Strain Gauge ADC (R20.1)
SG_ADC_6: Strain Gauge Amplifiers (A5.13 R9.1), Strain Gauge ADC (R21.1)
SG_ADC_7: Strain Gauge Amplifiers (A5.9 R11.1), Strain Gauge ADC (R16.1)
SG_ADC~{_RESET}: Connectors (P1.2), Strain Gauge ADC (A1.8)
SPI_EOC_0: ADC (U1.24), Microcontroller (U3.15)
SPI_EOC_0_2: ADC (U4#1.24), MicrocontrollerTwo (U6.15)
SPI_EOC_1: Microcontroller (U3.16), Strain Gauge ADC (A1.9)
SPI_MISO: ADC (U1.23), Microcontroller (U3.13), Strain Gauge ADC (A1.12)
SPI_MISO_2: ADC (U4#1.23), MicrocontrollerTwo (U6.13)
SPI_MOSI: ADC (U1.22), Microcontroller (U3.12), Strain Gauge ADC (A1.13)
SPI_MOSI_2: ADC (U4#1.22), MicrocontrollerTwo (U6.12)
SPI_SCK: ADC (U1.21), Connectors (J4.3), Microcontroller (U3.11), Strain Gauge ADC (A1.10)
SPI_SCK_2: ADC (U4#1.21), Connectors (J8.3), MicrocontrollerTwo (U6.11)
SPI_SS_0: ADC (U1.20), Microcontroller (U3.10)
SPI_SS_0_2: ADC (U4#1.20), MicrocontrollerTwo (U6.10)
SPI_SS_1: Microcontroller (U3.14), Strain Gauge ADC (A1.11)
TCK: Connectors (J3.1), Microcontroller (U3.57)
TCK_2: Connectors (J7.1), MicrocontrollerTwo (U6.57)
TDI: Connectors (J3.9), Microcontroller (U3.54)
TDI_2: Connectors (J7.9), MicrocontrollerTwo (U6.54)
TDO: Connectors (J3.3), Microcontroller (U3.55)
TDO_2: Connectors (J7.3), MicrocontrollerTwo (U6.55)
TMS: Connectors (J3.5), Microcontroller (U3.56)
TMS_2: Connectors (J7.5), MicrocontrollerTwo (U6.56)